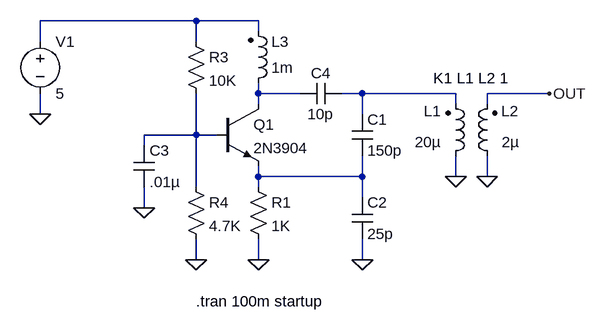
[diagram p0: schematic bipolarosc.asc]
bipolarosc.asc, the LTspice schematic file:
Version 4
SHEET 1 1284 720
WIRE 560 128 320 128
WIRE 656 128 560 128
WIRE 656 144 656 128
WIRE 320 160 320 128
WIRE 560 160 560 128
WIRE 656 240 656 224
WIRE 720 240 656 240
WIRE 816 240 784 240
WIRE 960 240 816 240
WIRE 1104 240 1008 240
WIRE 656 256 656 240
WIRE 960 256 960 240
WIRE 1008 256 1008 240
WIRE 320 272 320 240
WIRE 816 272 816 240
WIRE 560 304 560 240
WIRE 560 304 480 304
WIRE 592 304 560 304
WIRE 480 320 480 304
WIRE 656 368 656 352
WIRE 816 368 816 336
WIRE 816 368 656 368
WIRE 960 368 960 336
WIRE 1008 368 1008 336
WIRE 560 384 560 304
WIRE 656 384 656 368
WIRE 816 400 816 368
WIRE 480 416 480 384
WIRE 560 496 560 464
WIRE 656 496 656 464
WIRE 816 496 816 464
FLAG 656 496 0
FLAG 560 496 0
FLAG 960 368 0
FLAG 816 496 0
FLAG 320 272 0
FLAG 480 416 0
FLAG 1008 368 0
FLAG 1104 240 OUT
SYMBOL npn 592 256 R0
SYMATTR InstName Q1
SYMATTR Value 2N3904
SYMBOL ind2 944 352 M180
WINDOW 0 -6 85 Right 2
WINDOW 3 -7 37 Right 2
SYMATTR InstName L1
SYMATTR Value 20µ
SYMATTR Type ind
SYMBOL cap 800 272 R0
SYMATTR InstName C1
SYMATTR Value 150p
SYMBOL cap 800 400 R0
SYMATTR InstName C2
SYMATTR Value 25p
SYMBOL cap 464 320 R0
SYMATTR InstName C3
SYMATTR Value .01µ
SYMBOL res 640 368 R0
SYMATTR InstName R1
SYMATTR Value 1K
SYMBOL res 544 144 R0
SYMATTR InstName R3
SYMATTR Value 10K
SYMBOL res 544 368 R0
SYMATTR InstName R4
SYMATTR Value 4.7K
SYMBOL voltage 320 144 R0
SYMATTR InstName V1
SYMATTR Value 5
SYMBOL cap 784 224 R90
WINDOW 0 0 32 VBottom 2
WINDOW 3 32 32 VTop 2
SYMATTR InstName C4
SYMATTR Value 10p
SYMBOL ind2 640 240 M180
WINDOW 0 36 80 Left 2
WINDOW 3 36 40 Left 2
SYMATTR InstName L3
SYMATTR Value 1m
SYMATTR Type ind
SYMATTR Value2 Rser=100
SYMBOL ind2 1024 352 R180
WINDOW 0 -6 85 Right 2
WINDOW 3 -7 37 Right 2
SYMATTR InstName L2
SYMATTR Value 2µ
SYMATTR Type ind
TEXT 560 560 Left 2 !.tran 100m startup
TEXT 984 232 Bottom 2 !K1 L1 L2 1

The netlist it stands for:
* bipolarosc.asc
Q1 N002 N004 N005 0 2N3904
L1 0 N003 20µ
C1 N003 N005 150p
C2 N005 0 25p
C3 N004 0 .01µ
R1 N005 0 1K
R3 N001 N004 10K
R4 N004 0 4.7K
V1 N001 0 5
C4 N003 N002 10p
L3 N002 N001 1m Rser=100
L2 0 OUT 2µ
.model NPN NPN
.model PNP PNP
.lib standard.bjt
.tran 100m startup
K1 L1 L2 1
.backanno
.end